# EasyEDA schematic SCH_Pico-slide-show-2_2025-07-07.json
TITLE: Pico Slide Show; REV: 1.0; Date: 2025-07-07; Sheet: 1/1; Drawn By: raphael.boichot; Company: Raphaël BOICHOT
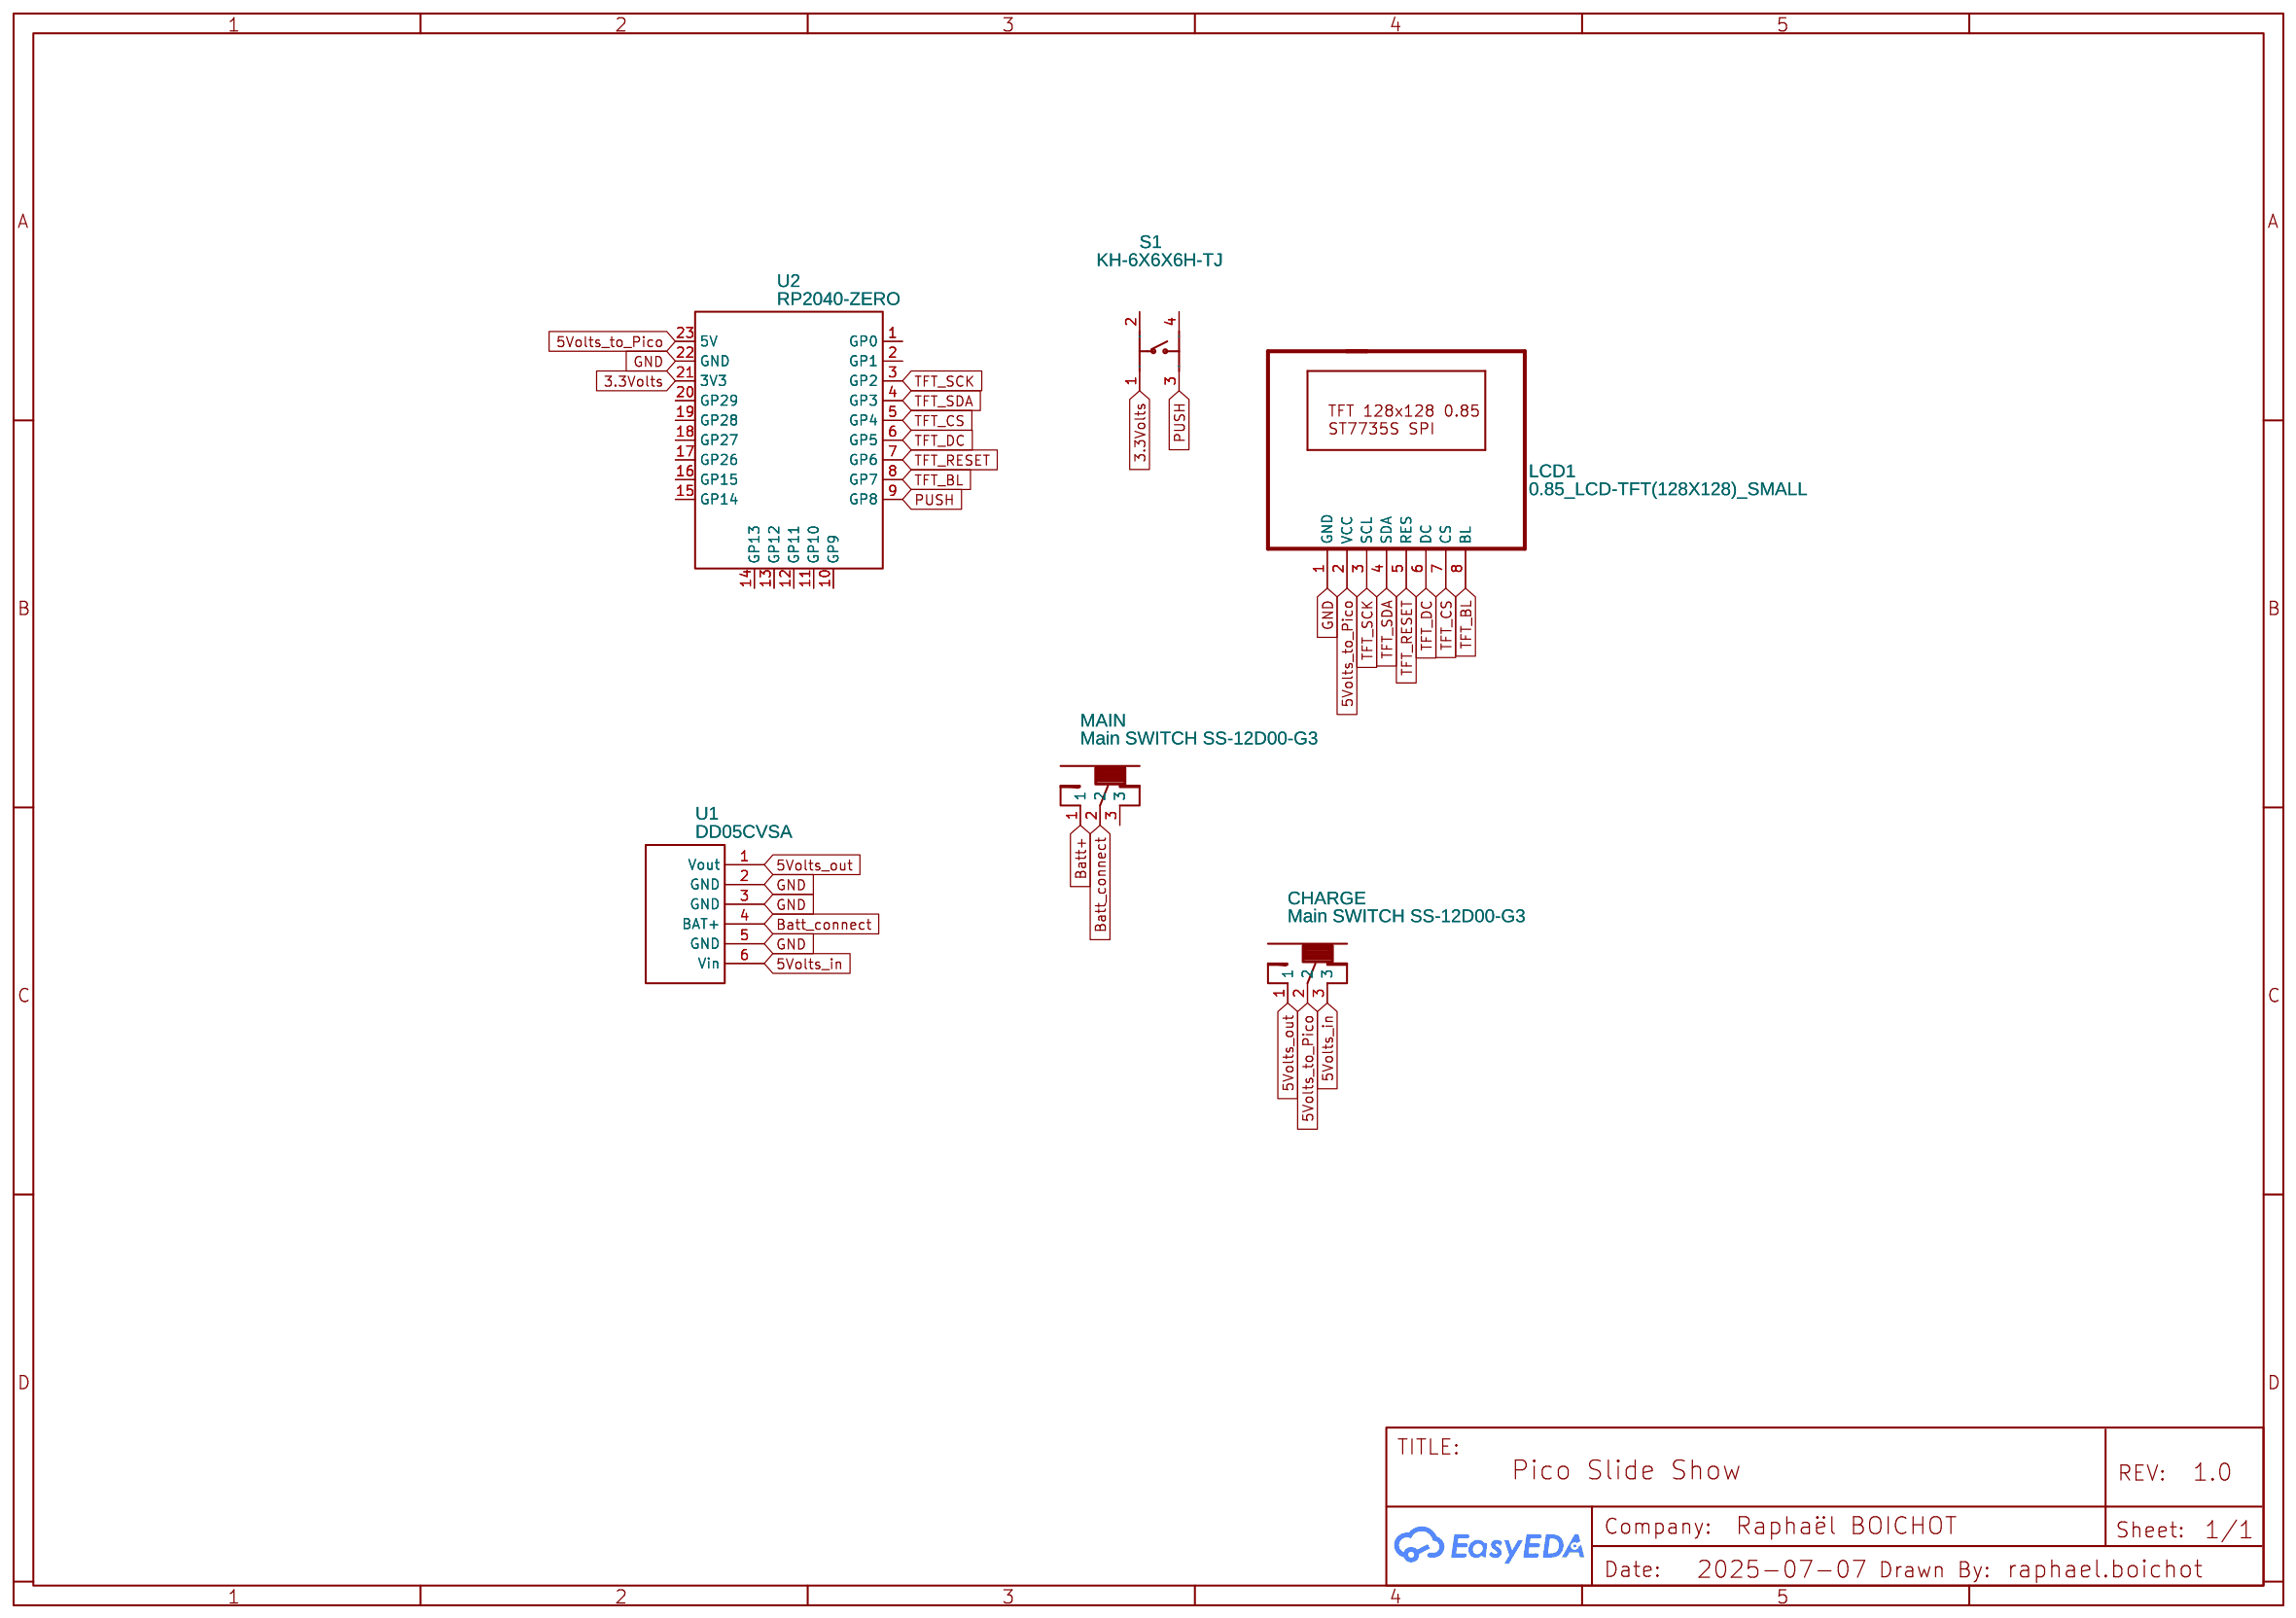
[diagram p0: schematic sheet]

## Parts
CHARGE  Main SWITCH SS-12D00-G3  [TOGGLE SWITCH SS-12D00-G3]
LCD1  0.85_LCD-TFT(128X128)_SMALL  [TFT1,44_SPI_128X128_ST7735S]
MAIN  Main SWITCH SS-12D00-G3  [TOGGLE SWITCH SS-12D00-G3]
S1  KH-6X6X6H-TJ  [SW-TH_4P-L6.0-W6.0-P4.50-LS6.5]
U1  DD05CVSA  [DD05CVSA]
U2  RP2040-ZERO  [RP2040-ZERO]

## Library data of the parts
CHARGE MAIN = TOGGLE SWITCH SS-12D00-G3: Supplier: aliexpress; Manufacturer: Dailywell; Contributor: Gibo222; link: https://de.aliexpress.com/item/32756772435.html?spm=a2g0o.productlist.0.0.4e077708sX2Al2&algo_pvid=716abed2-2433-4a4c-8d27-293a4e4961c2&algo_expid=716abed2-2433-4a4c-8d27-293a4e4961c2-8&btsid=2100bddd16119266912771087e59d6&ws_ab_test=searchweb0_0,searchweb201602_,searchweb201603_
LCD1 = 1.44_LCD-TFT(128X128)_SMALL: Contributor: roman.sokolov
S1 = KH-6X6X6H-TJ: Supplier: LCSC; Supplier Part: C2837516; Manufacturer: kinghelm(金航标); Contributor: LCSC; JLCPCB Part Class: Extended Part
U1 = DD05CVSA: Contributor: retret
U2 = RP2040-ZERO: Contributor: jhonatan6

## Nets
3.3Volts: S1.1 U2.21(3V3)
5Volts_in: CHARGE.3 U1.6(Vin)
5Volts_out: CHARGE.1 U1.1(Vout)
5Volts_to_Pico: CHARGE.2 LCD1.2(VCC) U2.23(5V)
GND: LCD1.1(GND) U1.2(GND) U1.3(GND) U1.5(GND) U2.22(GND)
Batt+: MAIN.1
Batt_connect: MAIN.2 U1.4(BAT+)
PUSH: S1.3 U2.9(GP8)
TFT_BL: LCD1.8(BL) U2.8(GP7)
TFT_CS: LCD1.7(CS) U2.5(GP4)
TFT_DC: LCD1.6(DC) U2.6(GP5)
TFT_RESET: LCD1.5(RES) U2.7(GP6)
TFT_SCK: LCD1.3(SCL) U2.3(GP2)
TFT_SDA: LCD1.4(SDA) U2.4(GP3)

Not connected (* = marked no-connect by the designer): MAIN 3; S1 2 4; U2 1(GP0) 2(GP1) 10(GP9) 11(GP10) 12(GP11) 13(GP12) 14(GP13) 15(GP14) 16(GP15) 17(GP26) 18(GP27) 19(GP28) 20(GP29)
